# EAGLE schematic Cineo-6-Channel_Buck_A1 (EAGLE 9.5.2)

## Sheet 1 of 7
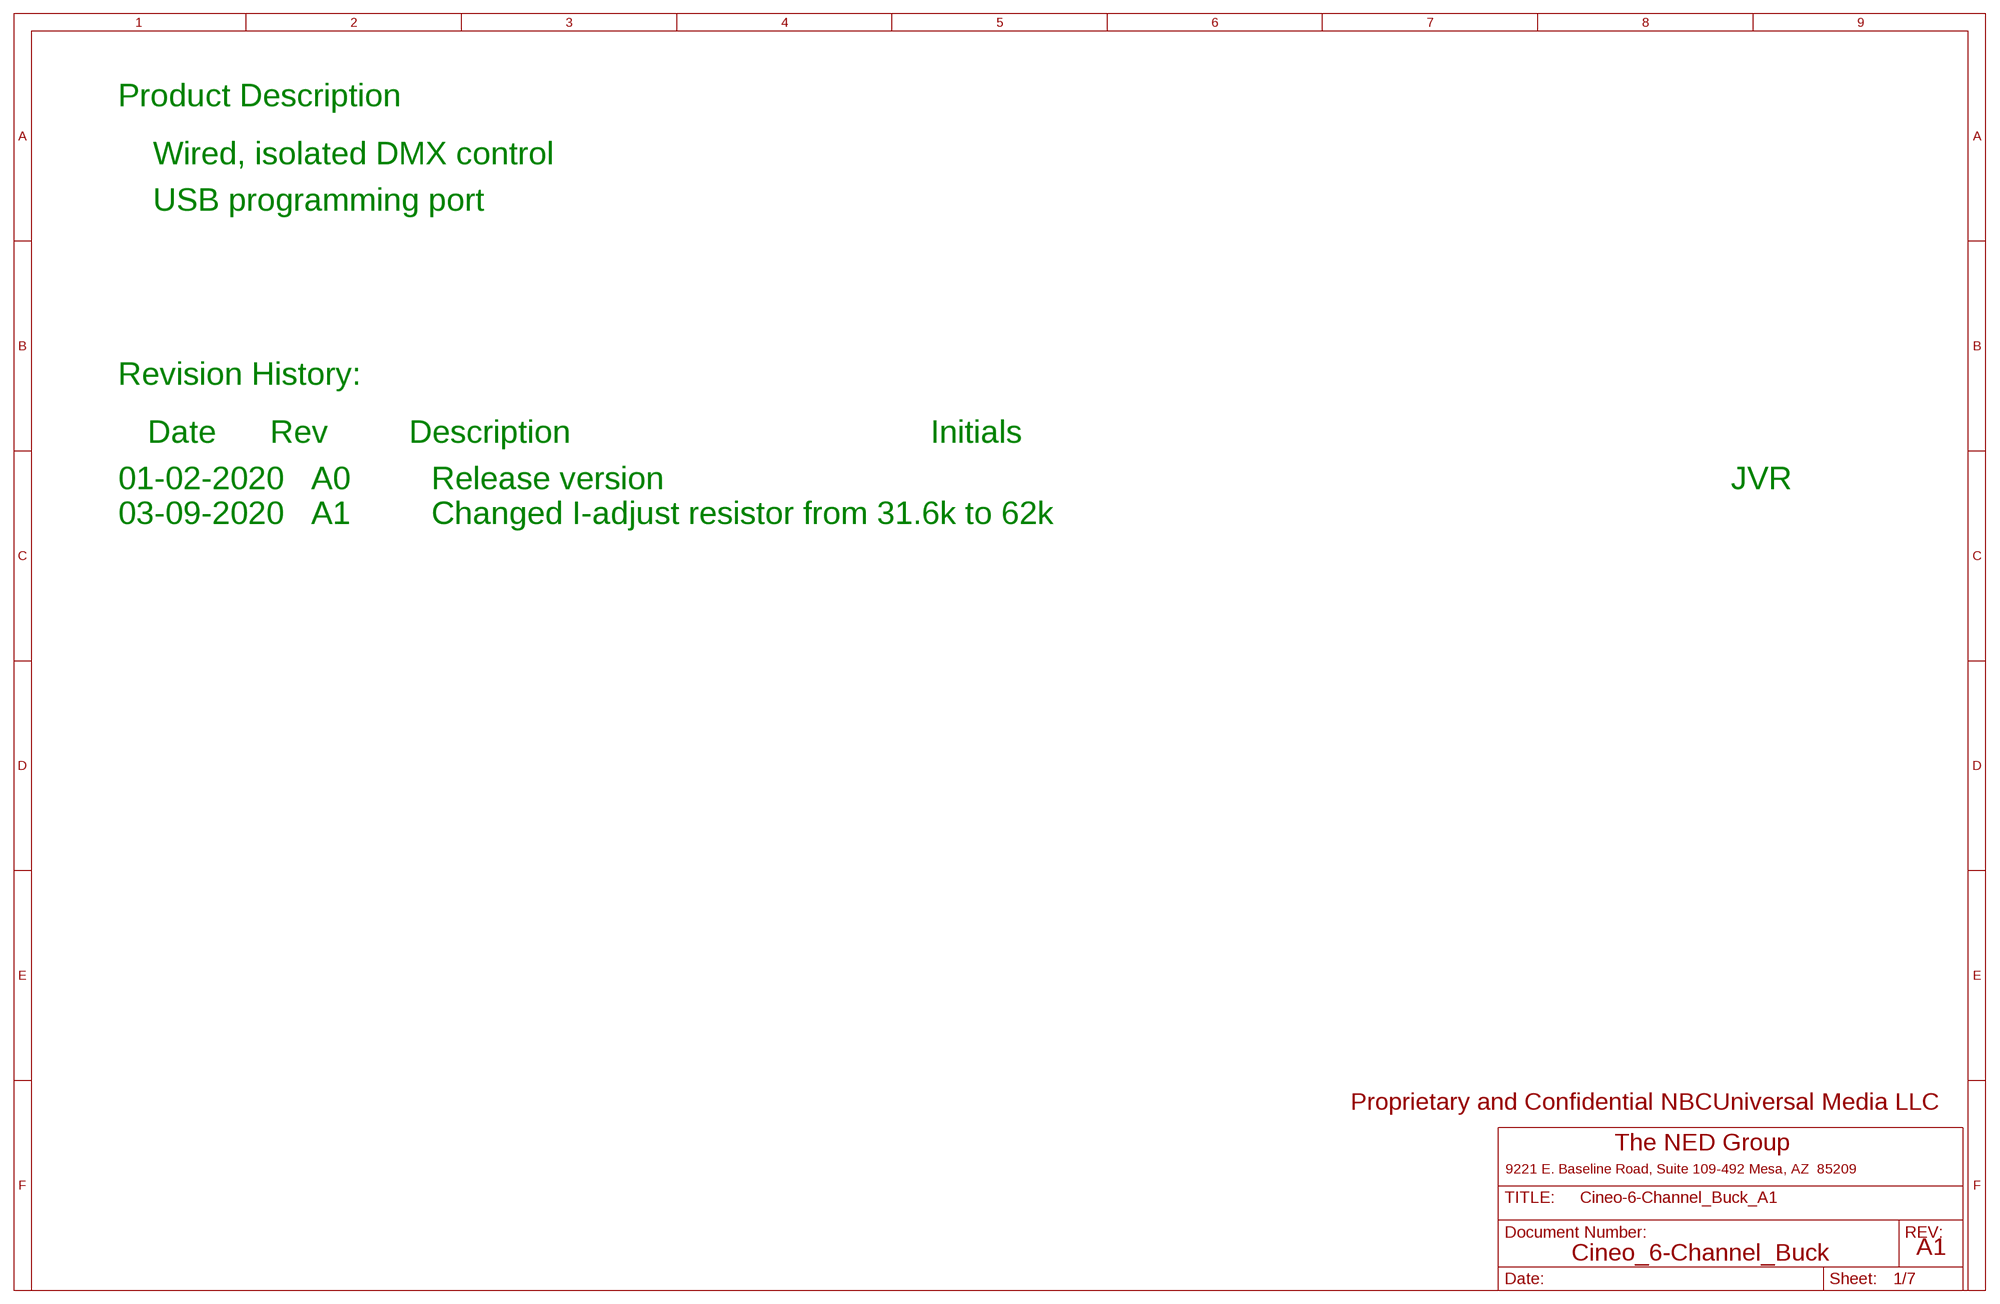
[diagram p0: schematic, sheet 1]

### Notes on the sheet
- Product Description
- Wired, isolated DMX control
- USB programming port
- Revision History:
- Date      Rev         Description                                        Initials
- 01-02-2020   A0         Release version | JVR
- 03-09-2020   A1         Changed I-adjust resistor from 31.6k to 62k
- Proprietary and Confidential NBCUniversal Media LLC
- The NED Group
- 9221 E. Baseline Road, Suite 109-492 Mesa, AZ  85209
- Cineo_6-Channel_Buck | A1

## Sheet 2 of 7
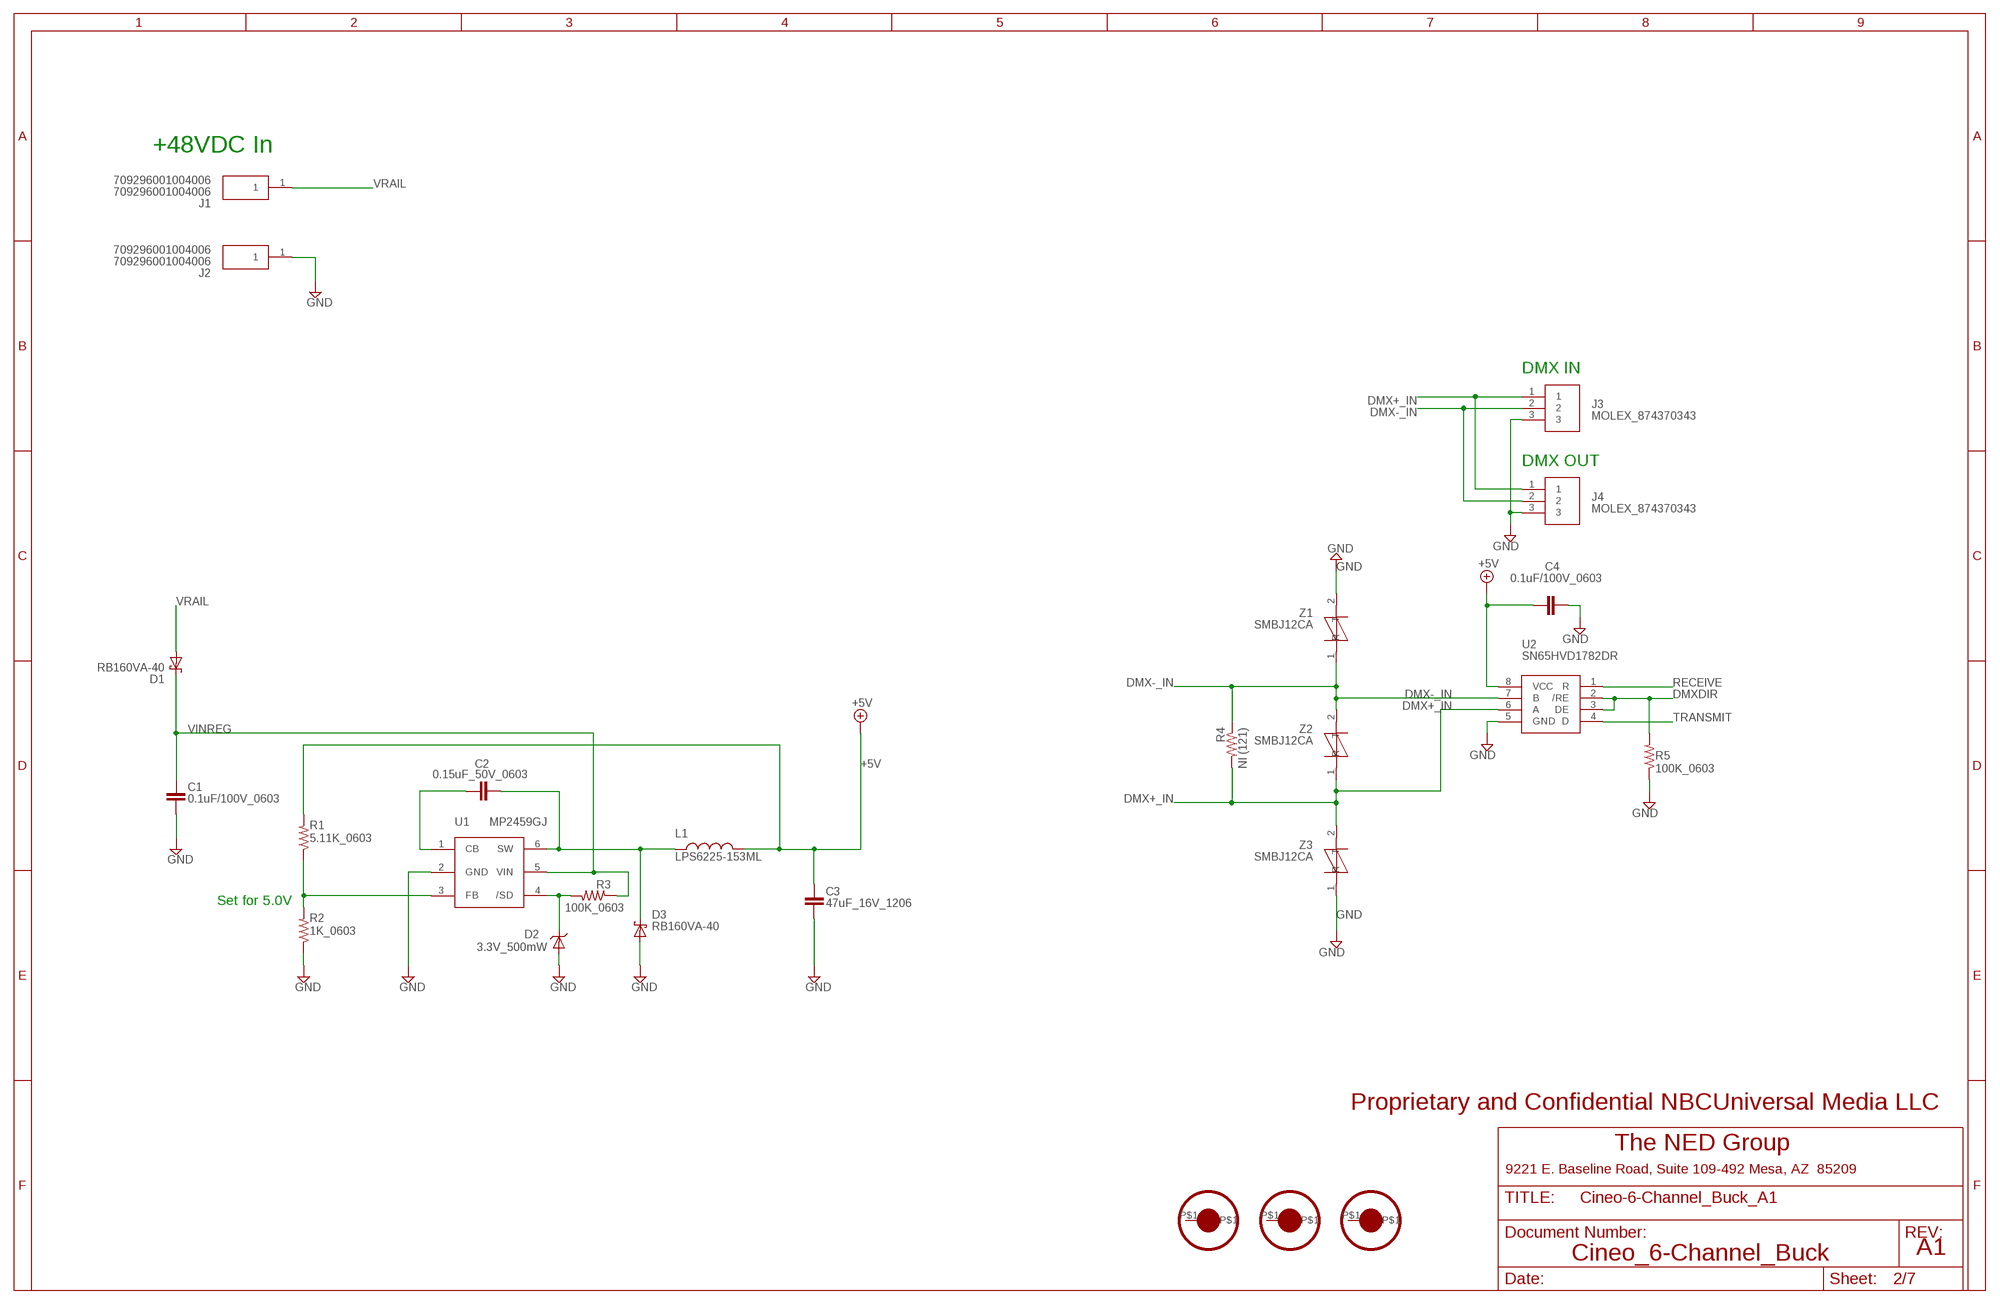
[diagram p1: schematic, sheet 2]

### Parts
C1  0.1uF/100V_0603  0603_0.1UF_100V  [C0603]
C2  0.15uF_50V_0603  0603_0.15_50V  [C0603]
C3  47uF_16V_1206  1206_47UF_16V  [C1206]
C4  0.1uF/100V_0603  0603_0.1UF_100V  [C0603]
D1  RB160VA-40  ROHM_RB160VA-40  [TUMD2]
D2  3.3V_500mW  ZENERSOD-123  [SOD-123]
D3  RB160VA-40  ROHM_RB160VA-40  [TUMD2]
FID1  FIDUCIALSSMALLER  [FIDUCIAL_1MMX3MM]
FID2  FIDUCIALSSMALLER  [FIDUCIAL_1MMX3MM]
FID3  FIDUCIALSSMALLER  [FIDUCIAL_1MMX3MM]
J1  709296001004006  AVX_709296001004006  [AVX_709296001004006]
J2  709296001004006  AVX_709296001004006  [AVX_709296001004006]
J3  MOLEX_874370343  [MOLEX_874370343]
J4  MOLEX_874370343  [MOLEX_874370343]
L1  LPS6225-153ML  COILCRAFT_LPS6225-153  [COILCRAFT_LPS6235]
R1  5.11K_0603  0603_5.11KΩ  [R0603]
R2  1K_0603  0603_1KΩ  [R0603]
R3  100K_0603  0603_100KΩ  [R0603]
R4  NI (121)  R-US_R0603  [R0603]
R5  100K_0603  R-US_R0603  [R0603]
U1  MP2459GJ  MPS_MP2459GJ  [TSOT_23-6]
U2  SN65HVD1782DR  TI_SN65HVD1782DR  [SO-8]
Z1  SMBJ12CA  TISP4360H3BJ  [SMBJ]
Z2  SMBJ12CA  TISP4360H3BJ  [SMBJ]
Z3  SMBJ12CA  TISP4360H3BJ  [SMBJ]

### Nets
+5V: C3.1 C4.1 L1.2 R1.2 U2.8(VCC) ; also sheet 3,4,5,6,7
DMX+_IN: J3.1 J4.1 R4.2 U2.6(A) Z2.1(R) Z3.2(T)
DMX-_IN: J3.2 J4.2 R4.1 U2.7(B) Z1.1(R) Z2.2(T)
DMXDIR: R5.2 U2.2(/RE) U2.3(DE) ; also sheet 3
GND [power]: C1.2 C3.2 C4.2 D2.A D3.A J2.1 J3.3 J4.3 R2.1 R5.1 U1.2(GND) U2.5(GND) Z1.2(T) Z3.1(R) ; also sheet 3,4,5,6,7
N$165: C2.1 U1.1(CB)
N$166: C2.2 D3.C L1.1 U1.6(SW)
N$167: R1.1 R2.2 U1.3(FB)
N$168: D2.C R3.2 U1.4(/SD)
RECEIVE: U2.1(R) ; also sheet 3
TRANSMIT: U2.4(D) ; also sheet 3
VINREG [power]: C1.1 D1.C R3.1 U1.5(VIN)
VRAIL [power]: D1.A J1.1 ; also sheet 3,5,6,7
Unconnected: FID1.P$1 FID2.P$1 FID3.P$1

### Notes on the sheet
- +48VDC In
- DMX IN
- DMX OUT
- Set for 5.0V
- Proprietary and Confidential NBCUniversal Media LLC
- The NED Group
- 9221 E. Baseline Road, Suite 109-492 Mesa, AZ  85209
- Cineo_6-Channel_Buck | A1

## Sheet 3 of 7
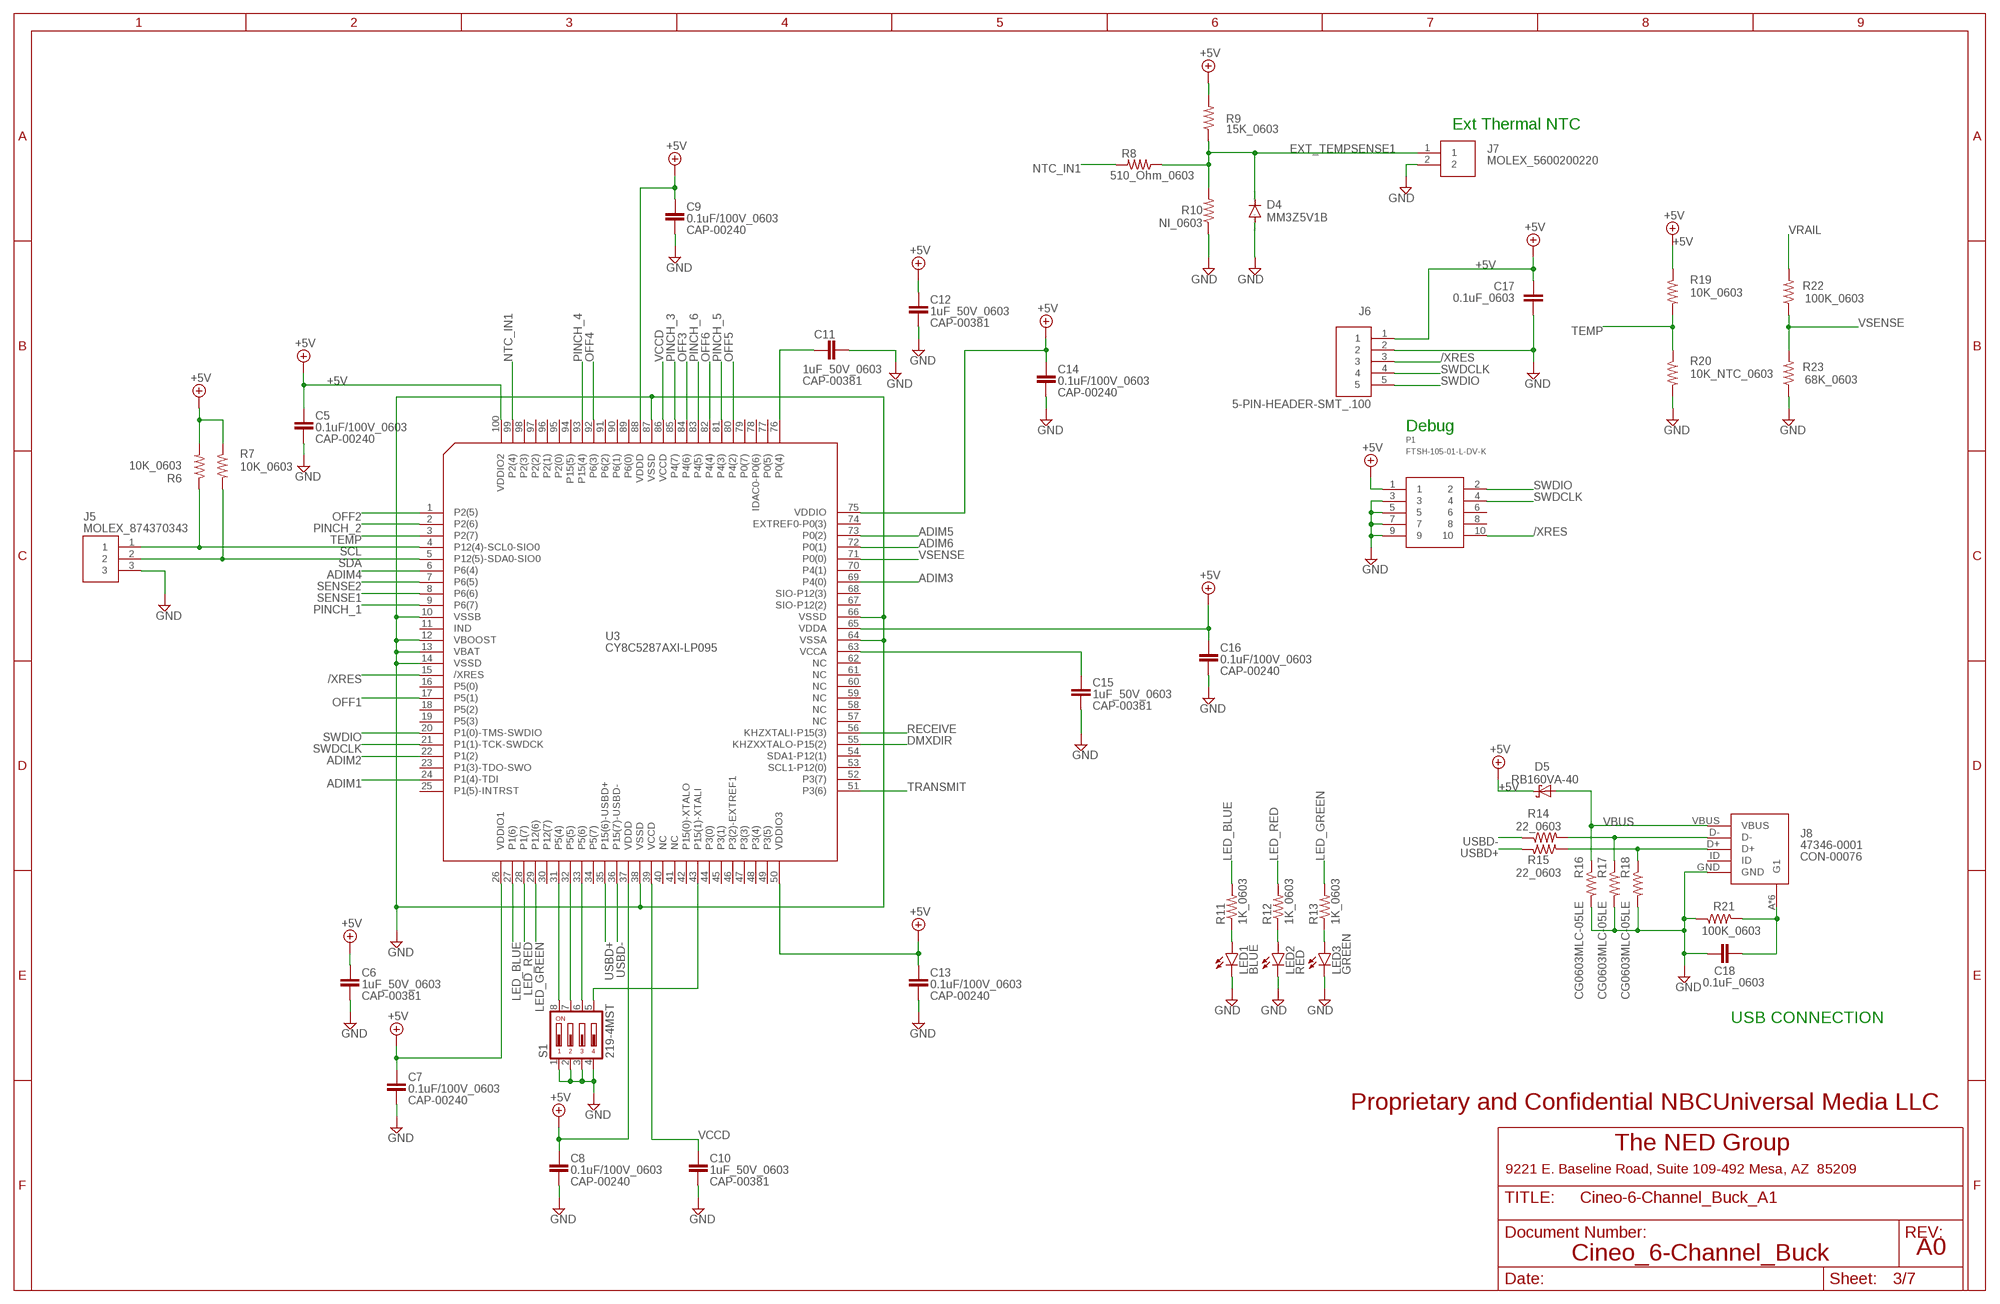
[diagram p2: schematic, sheet 3]

### Parts
C5  0.1uF/100V_0603  0603_0.1UF_100V  [C0603]
C6  1uF_50V_0603  0603_1UF_50V  [C0603]
C7  0.1uF/100V_0603  0603_0.1UF_100V  [C0603]
C8  0.1uF/100V_0603  0603_0.1UF_100V  [C0603]
C9  0.1uF/100V_0603  0603_0.1UF_100V  [C0603]
C10  1uF_50V_0603  0603_1UF_50V  [C0603]
C11  1uF_50V_0603  0603_1UF_50V  [C0603]
C12  1uF_50V_0603  0603_1UF_50V  [C0603]
C13  0.1uF/100V_0603  0603_0.1UF_100V  [C0603]
C14  0.1uF/100V_0603  0603_0.1UF_100V  [C0603]
C15  1uF_50V_0603  0603_1UF_50V  [C0603]
C16  0.1uF/100V_0603  0603_0.1UF_100V  [C0603]
C17  0.1uF_0603  C-EUC0603  [C0603]
C18  0.1uF_0603  C-EUC0603  [C0603]
D4  MM3Z5V1B  DIODE-SOD323-R  [SOD323-R]
D5  RB160VA-40  RSX051VA-30  [TUMD2]
J5  MOLEX_874370343  [MOLEX_874370343]
J6  5-PIN-HEADER-SMT_.100  [5-PIN_SMT_.100]
J7  MOLEX_5600200220  [MOLEX_5600200220]
J8  47346-0001  MOLEX_47346  [MOLEX_47346]
LED1  BLUE  LEDCHIPLED_0805  [CHIPLED_0805]
LED2  RED  LEDCHIPLED_0805  [CHIPLED_0805]
LED3  GREEN  LEDCHIPLED_0805  [CHIPLED_0805]
P1  FTSH-105-01-L-DV-K  [SAMTEC_FTSH-105-01-L-DV-K]
R6  10K_0603  R-US_R0603  [R0603]
R7  10K_0603  R-US_R0603  [R0603]
R8  510_Ohm_0603  R-US_R0603  [R0603]
R9  15K_0603  R-US_R0603  [R0603]
R10  NI_0603  R-US_R0603  [R0603]
R11  1K_0603  R-US_R0603  [R0603]
R12  1K_0603  R-US_R0603  [R0603]
R13  1K_0603  R-US_R0603  [R0603]
R14  22_0603  R-US_R0603  [R0603]
R15  22_0603  R-US_R0603  [R0603]
R16  CG0603MLC-05LE  R-US_R0603  [R0603]
R17  CG0603MLC-05LE  R-US_R0603  [R0603]
R18  CG0603MLC-05LE  R-US_R0603  [R0603]
R19  10K_0603  R-US_R0603  [R0603]
R20  10K_NTC_0603  R-US_R0603  [R0603]
R21  100K_0603  R-US_R0603  [R0603]
R22  100K_0603  R-US_R0603  [R0603]
R23  68K_0603  R-US_R0603  [R0603]
S1  219-4MST  219-04  [CTS-219-04]
U3  CY8C5287AXI-LP095  CYPRESS_CY8C52XX_100PIN5287  [TQFP100]

### Nets
+5V: C5.2 C6.2 C7.2 C8.2 C9.2 C12.2 C13.2 C14.2 C16.2 C17.1 D5.C J6.1 P1.1 R6.2 R7.1 R9.2 R19.1 U3.26(VDDIO1) U3.37(VDDD) U3.50(VDDIO3) U3.65(VDDA) U3.75(VDDIO) U3.88(VDDD) U3.100(VDDIO2) ; also sheet 2,4,5,6,7
/XRES: J6.3 P1.10 U3.15(/XRES)
ADIM1: U3.24(P1(4)-TDI) ; also sheet 4
ADIM2: U3.22(P1(2)) ; also sheet 4
ADIM3: U3.69(P4(0)) ; also sheet 4
ADIM4: U3.6(P6(4)) ; also sheet 4
ADIM5: U3.73(P0(2)) ; also sheet 4
ADIM6: U3.72(P0(1)) ; also sheet 4
DMXDIR: U3.55(KHZXXTALO-P15(2)) ; also sheet 2
EXT_TEMPSENSE1: D4.C J7.1 R8.1 R9.1 R10.2
GND [power]: C5.1 C6.1 C7.1 C8.1 C9.1 C10.1 C11.1 C12.1 C13.1 C14.1 C15.1 C16.1 C17.2 C18.2 D4.A J5.3 J6.2 J7.2 J8.GND LED1.C LED2.C LED3.C P1.3 P1.5 P1.7 P1.9 R10.1 R16.2 R17.2 R18.2 R20.2 R21.1 R23.1 S1.1 S1.2 S1.3 S1.4 U3.10(VSSB) U3.12(VBOOST) U3.13(VBAT) U3.14(VSSD) U3.38(VSSD) U3.64(VSSA) U3.66(VSSD) U3.87(VSSD) ; also sheet 2,4,5,6,7
LED_BLUE: R11.2 U3.27(P1(6))
LED_GREEN: R13.2 U3.29(P12(6))
LED_RED: R12.2 U3.28(P1(7))
N$1: C15.2 U3.63(VCCA)
N$2: S1.8 U3.31(P5(4))
N$6: S1.7 U3.32(P5(5))
N$7: C11.2 U3.76(P0(4))
N$18: S1.6 U3.33(P5(6))
N$19: S1.5 U3.43(P15(1)-XTALI)
N$24: LED3.A R13.1
N$31: LED2.A R12.1
N$96: J8.D- R14.2 R17.1
N$97: J8.D+ R15.1 R18.1
N$118: C18.1 J8.A(G1) J8.B(G1) J8.G1 J8.S2(G1) J8.S3(G1) J8.S4(G1) R21.2
N$172: LED1.A R11.1
NTC_IN1: R8.2 U3.99(P2(4))
OFF1: U3.17(P5(1)) ; also sheet 5
OFF2: U3.1(P2(5)) ; also sheet 5
OFF3: U3.84(P4(6)) ; also sheet 6
OFF4: U3.92(P6(3)) ; also sheet 6
OFF5: U3.80(P4(2)) ; also sheet 7
OFF6: U3.82(P4(4)) ; also sheet 7
PINCH_1: U3.9(P6(7)) ; also sheet 5
PINCH_2: U3.2(P2(6)) ; also sheet 5
PINCH_3: U3.85(P4(7)) ; also sheet 6
PINCH_4: U3.93(P15(4)) ; also sheet 6
PINCH_5: U3.81(P4(3)) ; also sheet 7
PINCH_6: U3.83(P4(5)) ; also sheet 7
RECEIVE: U3.56(KHZXTALI-P15(3)) ; also sheet 2
SCL: J5.1 R6.1 U3.4(P12(4)-SCL0-SIO0)
SDA: J5.2 R7.2 U3.5(P12(5)-SDA0-SIO0)
SENSE1: U3.8(P6(6)) ; also sheet 5
SENSE2: U3.7(P6(5)) ; also sheet 5
SWDCLK: J6.4 P1.4 U3.21(P1(1)-TCK-SWDCK)
SWDIO: J6.5 P1.2 U3.20(P1(0)-TMS-SWDIO)
TEMP: R19.2 R20.1 U3.3(P2(7))
TRANSMIT: U3.51(P3(6)) ; also sheet 2
USBD+: R15.2 U3.35(P15(6)-USBD+)
USBD-: R14.1 U3.36(P15(7)-USBD-)
VBUS: D5.A J8.VBUS R16.1
VCCD: C10.2 U3.39(VCCD) U3.86(VCCD)
VRAIL [power]: R22.2 ; also sheet 2,5,6,7
VSENSE: R22.1 R23.2 U3.71(P0(0))
Unconnected: J8.ID P1.6 P1.8 U3.11(IND) U3.16(P5(0)) U3.18(P5(2)) U3.19(P5(3)) U3.23(P1(3)-TDO-SWO) U3.25(P1(5)-INTRST) U3.30(P12(7)) U3.34(P5(7)) U3.40(NC) U3.41(NC) U3.42(P15(0)-XTALO) U3.44(P3(0)) U3.45(P3(1)) U3.46(P3(2)-EXTREF1) U3.47(P3(3)) U3.48(P3(4)) U3.49(P3(5)) U3.52(P3(7)) U3.53(SCL1-P12(0)) U3.54(SDA1-P12(1)) U3.57(NC) U3.58(NC) U3.59(NC) U3.60(NC) U3.61(NC) U3.62(NC) U3.67(SIO-P12(2)) U3.68(SIO-P12(3)) U3.70(P4(1)) U3.74(EXTREF0-P0(3)) U3.77(P0(5)) U3.78(IDAC0-P0(6)) U3.79(P0(7)) U3.89(P6(0)) U3.90(P6(1)) U3.91(P6(2)) U3.94(P15(5)) U3.95(P2(0)) U3.96(P2(1)) U3.97(P2(2)) U3.98(P2(3))

### Notes on the sheet
- Ext Thermal NTC
- Debug
- USB CONNECTION
- Proprietary and Confidential NBCUniversal Media LLC
- The NED Group
- 9221 E. Baseline Road, Suite 109-492 Mesa, AZ  85209
- Cineo_6-Channel_Buck | A0

## Sheet 4 of 7
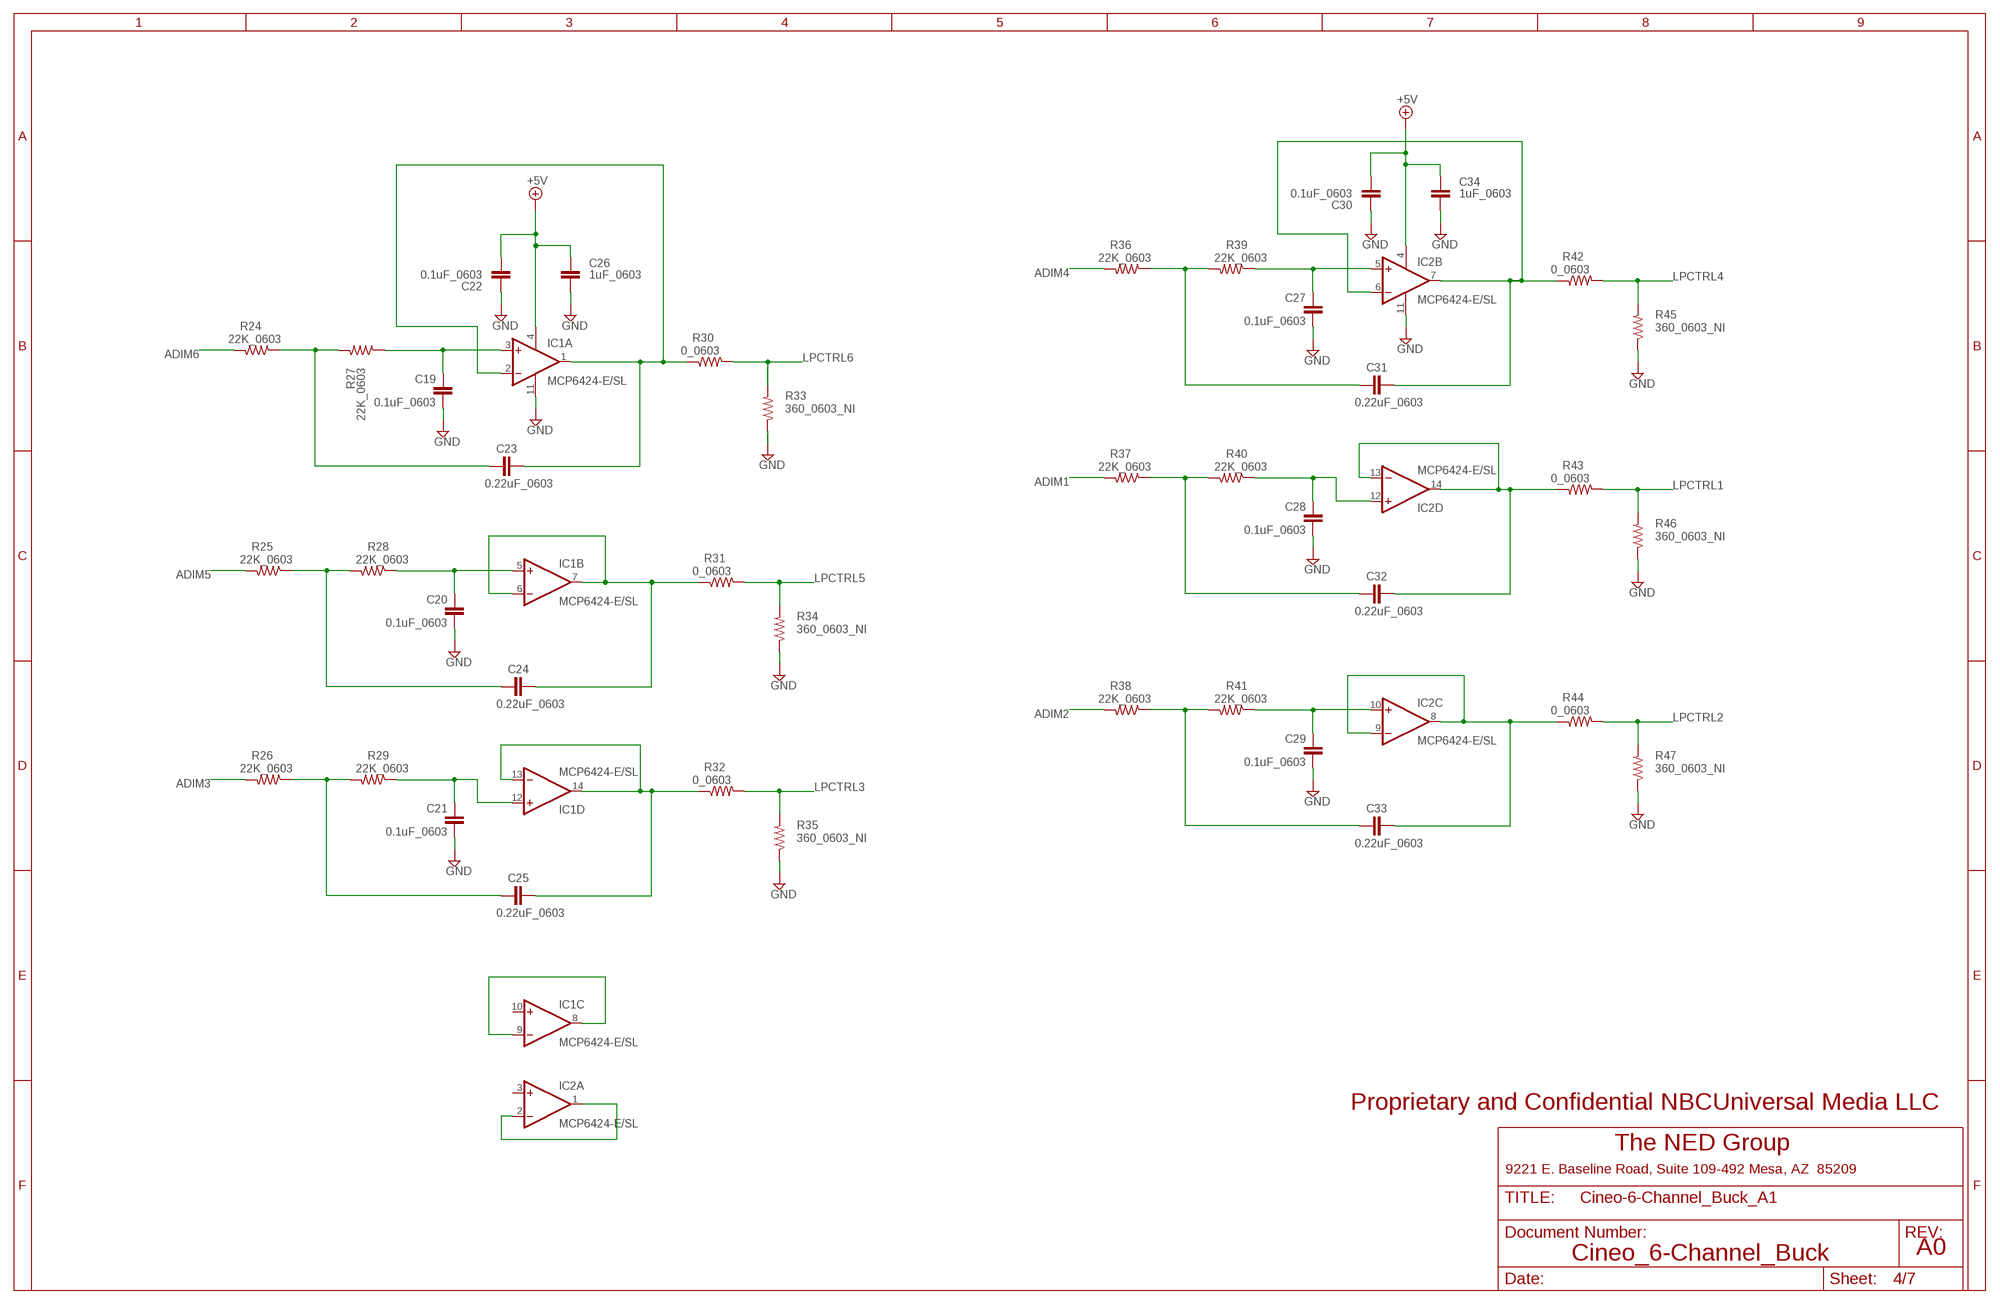
[diagram p3: schematic, sheet 4]

### Parts
C19  0.1uF_0603  C-EUC0603  [C0603]
C20  0.1uF_0603  C-EUC0603  [C0603]
C21  0.1uF_0603  C-EUC0603  [C0603]
C22  0.1uF_0603  C-EUC0603  [C0603]
C23  0.22uF_0603  C-EUC0603  [C0603]
C24  0.22uF_0603  C-EUC0603  [C0603]
C25  0.22uF_0603  C-EUC0603  [C0603]
C26  1uF_0603  C-EUC0603  [C0603]
C27  0.1uF_0603  C-EUC0603  [C0603]
C28  0.1uF_0603  C-EUC0603  [C0603]
C29  0.1uF_0603  C-EUC0603  [C0603]
C30  0.1uF_0603  C-EUC0603  [C0603]
C31  0.22uF_0603  C-EUC0603  [C0603]
C32  0.22uF_0603  C-EUC0603  [C0603]
C33  0.22uF_0603  C-EUC0603  [C0603]
C34  1uF_0603  C-EUC0603  [C0603]
IC1  MCP6424-E/SL  TLC274D  [SO14]
IC2  MCP6424-E/SL  TLC274D  [SO14]
R24  22K_0603  R-US_R0603  [R0603]
R25  22K_0603  R-US_R0603  [R0603]
R26  22K_0603  R-US_R0603  [R0603]
R27  22K_0603  R-US_R0603  [R0603]
R28  22K_0603  R-US_R0603  [R0603]
R29  22K_0603  R-US_R0603  [R0603]
R30  0_0603  R-US_R0603  [R0603]
R31  0_0603  R-US_R0603  [R0603]
R32  0_0603  R-US_R0603  [R0603]
R33  360_0603_NI  R-US_R0603  [R0603]
R34  360_0603_NI  R-US_R0603  [R0603]
R35  360_0603_NI  R-US_R0603  [R0603]
R36  22K_0603  R-US_R0603  [R0603]
R37  22K_0603  R-US_R0603  [R0603]
R38  22K_0603  R-US_R0603  [R0603]
R39  22K_0603  R-US_R0603  [R0603]
R40  22K_0603  R-US_R0603  [R0603]
R41  22K_0603  R-US_R0603  [R0603]
R42  0_0603  R-US_R0603  [R0603]
R43  0_0603  R-US_R0603  [R0603]
R44  0_0603  R-US_R0603  [R0603]
R45  360_0603_NI  R-US_R0603  [R0603]
R46  360_0603_NI  R-US_R0603  [R0603]
R47  360_0603_NI  R-US_R0603  [R0603]

### Nets
+5V: C22.1 C26.2 C30.1 C34.2 IC1.4(P:V+) IC2.4(P:V+) ; also sheet 2,3,5,6,7
ADIM1: R37.2 ; also sheet 3
ADIM2: R38.2 ; also sheet 3
ADIM3: R26.2 ; also sheet 3
ADIM4: R36.2 ; also sheet 3
ADIM5: R25.2 ; also sheet 3
ADIM6: R24.2 ; also sheet 3
GND [power]: C19.1 C20.1 C21.1 C22.2 C26.1 C27.1 C28.1 C29.1 C30.2 C34.1 IC1.11(P:V-) IC2.11(P:V-) R33.1 R34.1 R35.1 R45.1 R46.1 R47.1 ; also sheet 2,3,5,6,7
LPCTRL1: R43.2 R46.2 ; also sheet 5
LPCTRL2: R44.2 R47.2 ; also sheet 5
LPCTRL3: R32.2 R35.2 ; also sheet 6
LPCTRL4: R42.2 R45.2 ; also sheet 6
LPCTRL5: R31.2 R34.2 ; also sheet 7
LPCTRL6: R30.2 R33.2 ; also sheet 7
N$3: C24.1 R25.1 R28.2
N$4: C20.2 IC1.5(B:+IN) R28.1
N$8: C24.2 IC1.6(B:-IN) IC1.7(B:OUT) R31.1
N$10: C23.1 R24.1 R27.2
N$13: C19.2 IC1.3(A:+IN) R27.1
N$14: IC1.8(C:OUT) IC1.9(C:-IN)
N$15: C25.1 R26.1 R29.2
N$16: C21.2 IC1.12(D:+IN) R29.1
N$17: C25.2 IC1.13(D:-IN) IC1.14(D:OUT) R32.1
N$20: IC2.1(A:OUT) IC2.2(A:-IN)
N$21: C23.2 IC1.1(A:OUT) IC1.2(A:-IN) R30.1
N$135: C31.1 R36.1 R39.2
N$136: C27.2 IC2.5(B:+IN) R39.1
N$137: C31.2 IC2.6(B:-IN) IC2.7(B:OUT) R42.1
N$138: C33.1 R38.1 R41.2
N$155: C29.2 IC2.10(C:+IN) R41.1
N$156: C33.2 IC2.8(C:OUT) IC2.9(C:-IN) R44.1
N$157: C32.1 R37.1 R40.2
N$158: C28.2 IC2.12(D:+IN) R40.1
N$159: C32.2 IC2.13(D:-IN) IC2.14(D:OUT) R43.1
Unconnected: IC1.10(C:+IN) IC2.3(A:+IN)

### Notes on the sheet
- Proprietary and Confidential NBCUniversal Media LLC
- The NED Group
- 9221 E. Baseline Road, Suite 109-492 Mesa, AZ  85209
- Cineo_6-Channel_Buck | A0

## Sheet 5 of 7
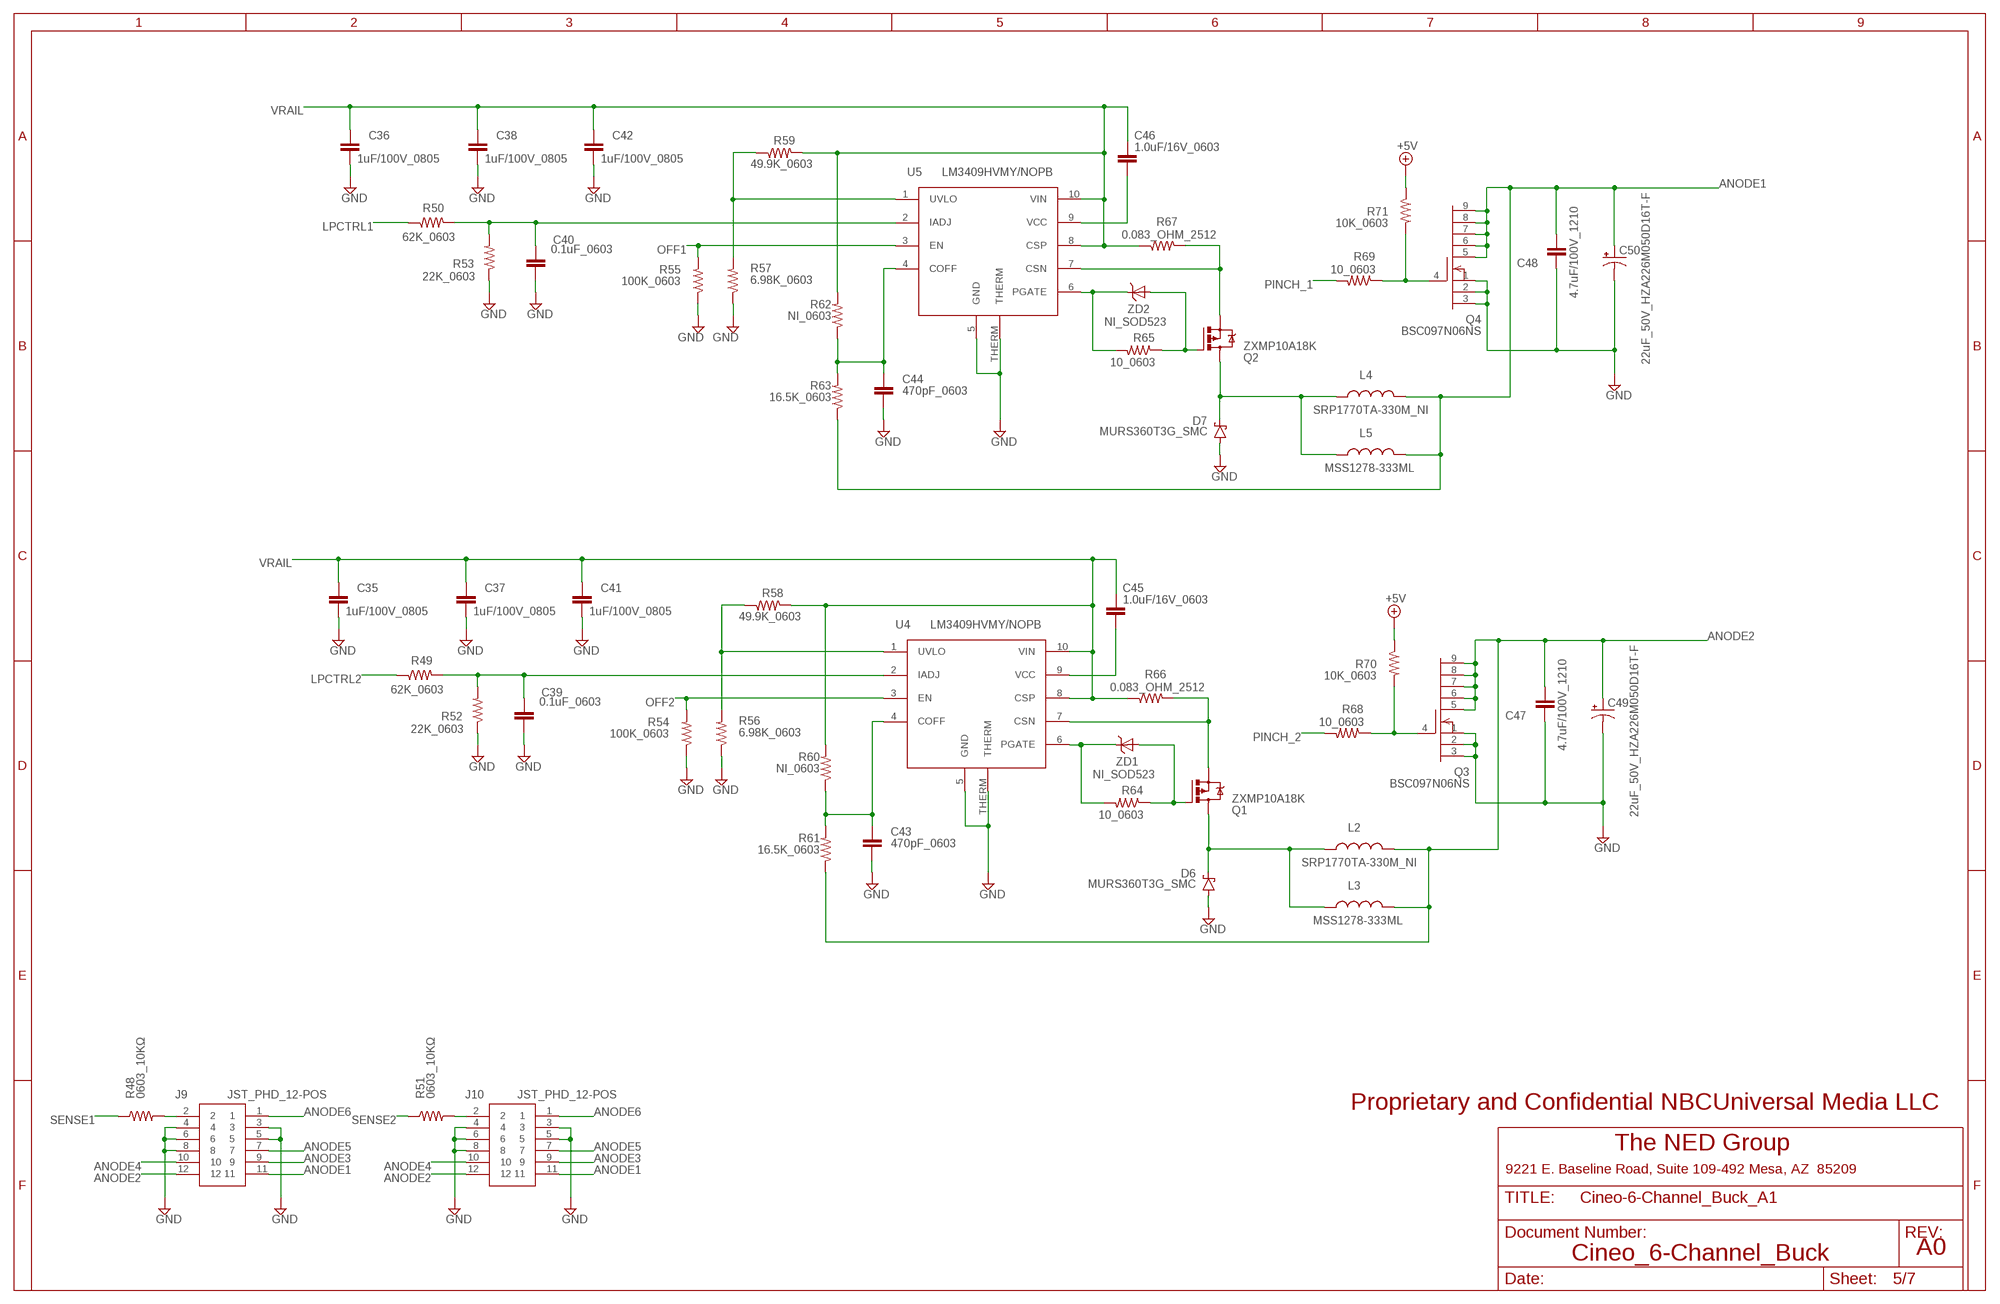
[diagram p4: schematic, sheet 5]

### Parts
C35  1uF/100V_0805  C-EUC0805  [C0805]
C36  1uF/100V_0805  C-EUC0805  [C0805]
C37  1uF/100V_0805  C-EUC0805  [C0805]
C38  1uF/100V_0805  C-EUC0805  [C0805]
C39  0.1uF_0603  C-EUC0603  [C0603]
C40  0.1uF_0603  C-EUC0603  [C0603]
C41  1uF/100V_0805  C-EUC0805  [C0805]
C42  1uF/100V_0805  C-EUC0805  [C0805]
C43  470pF_0603  C-EUC0603  [C0603]
C44  470pF_0603  C-EUC0603  [C0603]
C45  1.0uF/16V_0603  C-EUC0603  [C0603]
C46  1.0uF/16V_0603  C-EUC0603  [C0603]
C47  4.7uF/100V_1210  C-EUC1210  [C1210]
C48  4.7uF/100V_1210  C-EUC1210  [C1210]
C49  22uF_50V_HZA226M050D16T-F  CPOL-USD  [PANASONIC_D]
C50  22uF_50V_HZA226M050D16T-F  CPOL-USD  [PANASONIC_D]
D6  MURS360T3G_SMC  SCHOTTKY-DIODESMC  [SMC]
D7  MURS360T3G_SMC  SCHOTTKY-DIODESMC  [SMC]
J9  JST_PHD_12-POS  [JST_PHD_12-POS]
J10  JST_PHD_12-POS  [JST_PHD_12-POS]
L2  SRP1770TA-330M_NI  BOURNS_SRP1770TA  [BOURNS_SRP1770TA]
L3  MSS1278-333ML  COILCRAFT_MSS1260  [MSS1260]
L4  SRP1770TA-330M_NI  BOURNS_SRP1770TA  [BOURNS_SRP1770TA]
L5  MSS1278-333ML  COILCRAFT_MSS1260  [MSS1260]
Q1  ZXMP10A18K  MOSFET_P-CHANNEL_3LEADTAB_SOURCE  [DPAK]
Q2  ZXMP10A18K  MOSFET_P-CHANNEL_3LEADTAB_SOURCE  [DPAK]
Q3  BSC097N06NS  SI7464DP_SO8_POWERPAC  [SO-8_POWERPAC]
Q4  BSC097N06NS  SI7464DP_SO8_POWERPAC  [SO-8_POWERPAC]
R48  0603_10KΩ  [R0603]
R49  62K_0603  R-US_R0603  [R0603]
R50  62K_0603  R-US_R0603  [R0603]
R51  0603_10KΩ  [R0603]
R52  22K_0603  R-US_R0603  [R0603]
R53  22K_0603  R-US_R0603  [R0603]
R54  100K_0603  R-US_R0603  [R0603]
R55  100K_0603  R-US_R0603  [R0603]
R56  6.98K_0603  R-US_R0603  [R0603]
R57  6.98K_0603  R-US_R0603  [R0603]
R58  49.9K_0603  R-US_R0603  [R0603]
R59  49.9K_0603  R-US_R0603  [R0603]
R60  NI_0603  R-US_R0603  [R0603]
R61  16.5K_0603  R-US_R0603  [R0603]
R62  NI_0603  R-US_R0603  [R0603]
R63  16.5K_0603  R-US_R0603  [R0603]
R64  10_0603  R-US_R0603  [R0603]
R65  10_0603  R-US_R0603  [R0603]
R66  0.083_OHM_2512  R-US_R2512  [R2512]
R67  0.083_OHM_2512  R-US_R2512  [R2512]
R68  10_0603  R-US_R0603  [R0603]
R69  10_0603  R-US_R0603  [R0603]
R70  10K_0603  R-US_R0603  [R0603]
R71  10K_0603  R-US_R0603  [R0603]
U4  LM3409HVMY/NOPB  LM3409HV  [MSOP10-THERMALENHANCED]
U5  LM3409HVMY/NOPB  LM3409HV  [MSOP10-THERMALENHANCED]
ZD1  NI_SOD523  ZENER_SOD-523  [SOD-523]
ZD2  NI_SOD523  ZENER_SOD-523  [SOD-523]

### Nets
+5V: R70.1 R71.1 ; also sheet 2,3,4,6,7
ANODE1: C48.2 C50.+ J9.11 J10.11 L4.P$2 L5.2 Q4.5(D) Q4.6(D1) Q4.7(D2) Q4.8(D3) Q4.9(D4) R63.1
ANODE2: C47.2 C49.+ J9.12 J10.12 L2.P$2 L3.2 Q3.5(D) Q3.6(D1) Q3.7(D2) Q3.8(D3) Q3.9(D4) R61.1
ANODE3: J9.9 J10.9 ; also sheet 6
ANODE4: J9.10 J10.10 ; also sheet 6
ANODE5: J9.7 J10.7 ; also sheet 7
ANODE6: J9.1 J10.1 ; also sheet 7
GND [power]: C35.2 C36.2 C37.2 C38.2 C39.1 C40.1 C41.2 C42.2 C43.1 C44.1 C47.1 C48.1 C49.- C50.- D6.A D7.A J9.3 J9.4 J9.5 J9.6 J9.8 J10.3 J10.4 J10.5 J10.6 J10.8 Q3.1(S) Q3.2(S1) Q3.3(S2) Q4.1(S) Q4.2(S1) Q4.3(S2) R52.1 R53.1 R54.1 R55.1 R56.1 R57.1 U4.5(GND) U4.THERM U5.5(GND) U5.THERM ; also sheet 2,3,4,6,7
LPCTRL1: R50.1 ; also sheet 4
LPCTRL2: R49.1 ; also sheet 4
N$5: C44.2 R62.1 R63.2 U5.4(COFF)
N$9: C46.1 U5.9(VCC)
N$11: Q2.E(S) R67.2 U5.7(CSN)
N$12: Q2.B(G) R65.1 ZD2.A
N$23: R65.2 U5.6(PGATE) ZD2.C
N$25: D7.C L4.P$1 L5.1 Q2.C(D)
N$28: J9.2 R48.2
N$29: J10.2 R51.2
N$40: R56.2 R58.1 U4.1(UVLO)
N$41: C39.2 R49.2 R52.2 U4.2(IADJ)
N$42: Q3.4(G) R68.1 R70.2
N$43: C43.2 R60.1 R61.2 U4.4(COFF)
N$44: C45.1 U4.9(VCC)
N$45: Q1.E(S) R66.2 U4.7(CSN)
N$46: Q1.B(G) R64.1 ZD1.A
N$47: R64.2 U4.6(PGATE) ZD1.C
N$48: D6.C L2.P$1 L3.1 Q1.C(D)
N$69: R57.2 R59.1 U5.1(UVLO)
N$80: C40.2 R50.2 R53.2 U5.2(IADJ)
N$82: Q4.4(G) R69.1 R71.2
OFF1: R55.2 U5.3(EN) ; also sheet 3
OFF2: R54.2 U4.3(EN) ; also sheet 3
PINCH_1: R69.2 ; also sheet 3
PINCH_2: R68.2 ; also sheet 3
SENSE1: R48.1 ; also sheet 3
SENSE2: R51.1 ; also sheet 3
VRAIL [power]: C35.1 C36.1 C37.1 C38.1 C41.1 C42.1 C45.2 C46.2 R58.2 R59.2 R60.2 R62.2 R66.1 R67.1 U4.8(CSP) U4.10(VIN) U5.8(CSP) U5.10(VIN) ; also sheet 2,3,6,7

### Notes on the sheet
- Proprietary and Confidential NBCUniversal Media LLC
- The NED Group
- 9221 E. Baseline Road, Suite 109-492 Mesa, AZ  85209
- Cineo_6-Channel_Buck | A0

## Sheet 6 of 7
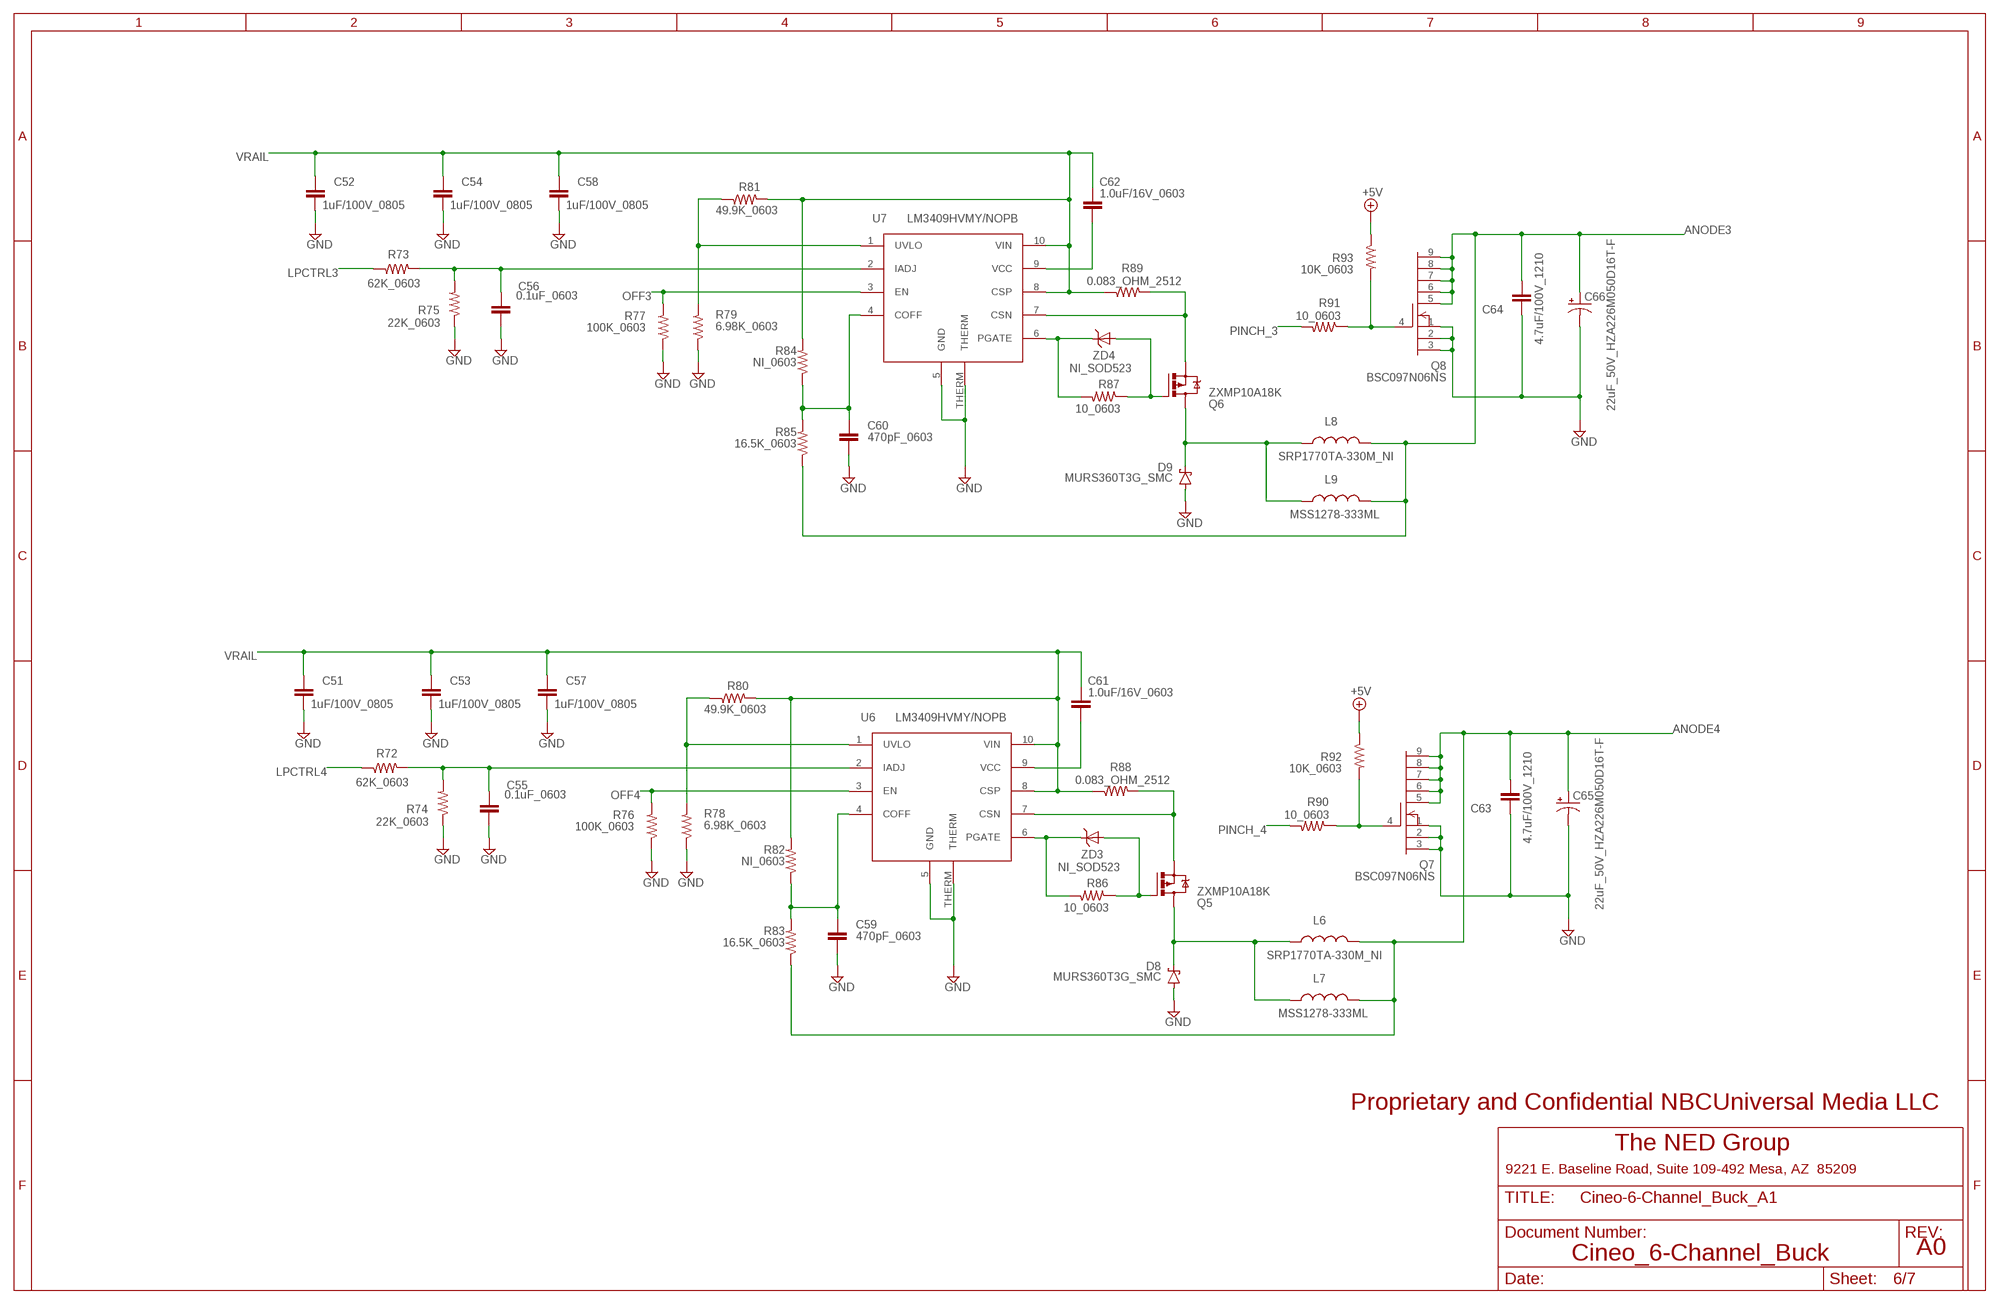
[diagram p5: schematic, sheet 6]

### Parts
C51  1uF/100V_0805  C-EUC0805  [C0805]
C52  1uF/100V_0805  C-EUC0805  [C0805]
C53  1uF/100V_0805  C-EUC0805  [C0805]
C54  1uF/100V_0805  C-EUC0805  [C0805]
C55  0.1uF_0603  C-EUC0603  [C0603]
C56  0.1uF_0603  C-EUC0603  [C0603]
C57  1uF/100V_0805  C-EUC0805  [C0805]
C58  1uF/100V_0805  C-EUC0805  [C0805]
C59  470pF_0603  C-EUC0603  [C0603]
C60  470pF_0603  C-EUC0603  [C0603]
C61  1.0uF/16V_0603  C-EUC0603  [C0603]
C62  1.0uF/16V_0603  C-EUC0603  [C0603]
C63  4.7uF/100V_1210  C-EUC1210  [C1210]
C64  4.7uF/100V_1210  C-EUC1210  [C1210]
C65  22uF_50V_HZA226M050D16T-F  CPOL-USD  [PANASONIC_D]
C66  22uF_50V_HZA226M050D16T-F  CPOL-USD  [PANASONIC_D]
D8  MURS360T3G_SMC  SCHOTTKY-DIODESMC  [SMC]
D9  MURS360T3G_SMC  SCHOTTKY-DIODESMC  [SMC]
L6  SRP1770TA-330M_NI  BOURNS_SRP1770TA  [BOURNS_SRP1770TA]
L7  MSS1278-333ML  COILCRAFT_MSS1260  [MSS1260]
L8  SRP1770TA-330M_NI  BOURNS_SRP1770TA  [BOURNS_SRP1770TA]
L9  MSS1278-333ML  COILCRAFT_MSS1260  [MSS1260]
Q5  ZXMP10A18K  MOSFET_P-CHANNEL_3LEADTAB_SOURCE  [DPAK]
Q6  ZXMP10A18K  MOSFET_P-CHANNEL_3LEADTAB_SOURCE  [DPAK]
Q7  BSC097N06NS  SI7464DP_SO8_POWERPAC  [SO-8_POWERPAC]
Q8  BSC097N06NS  SI7464DP_SO8_POWERPAC  [SO-8_POWERPAC]
R72  62K_0603  R-US_R0603  [R0603]
R73  62K_0603  R-US_R0603  [R0603]
R74  22K_0603  R-US_R0603  [R0603]
R75  22K_0603  R-US_R0603  [R0603]
R76  100K_0603  R-US_R0603  [R0603]
R77  100K_0603  R-US_R0603  [R0603]
R78  6.98K_0603  R-US_R0603  [R0603]
R79  6.98K_0603  R-US_R0603  [R0603]
R80  49.9K_0603  R-US_R0603  [R0603]
R81  49.9K_0603  R-US_R0603  [R0603]
R82  NI_0603  R-US_R0603  [R0603]
R83  16.5K_0603  R-US_R0603  [R0603]
R84  NI_0603  R-US_R0603  [R0603]
R85  16.5K_0603  R-US_R0603  [R0603]
R86  10_0603  R-US_R0603  [R0603]
R87  10_0603  R-US_R0603  [R0603]
R88  0.083_OHM_2512  R-US_R2512  [R2512]
R89  0.083_OHM_2512  R-US_R2512  [R2512]
R90  10_0603  R-US_R0603  [R0603]
R91  10_0603  R-US_R0603  [R0603]
R92  10K_0603  R-US_R0603  [R0603]
R93  10K_0603  R-US_R0603  [R0603]
U6  LM3409HVMY/NOPB  LM3409HV  [MSOP10-THERMALENHANCED]
U7  LM3409HVMY/NOPB  LM3409HV  [MSOP10-THERMALENHANCED]
ZD3  NI_SOD523  ZENER_SOD-523  [SOD-523]
ZD4  NI_SOD523  ZENER_SOD-523  [SOD-523]

### Nets
+5V: R92.1 R93.1 ; also sheet 2,3,4,5,7
ANODE3: C64.2 C66.+ L8.P$2 L9.2 Q8.5(D) Q8.6(D1) Q8.7(D2) Q8.8(D3) Q8.9(D4) R85.1 ; also sheet 5
ANODE4: C63.2 C65.+ L6.P$2 L7.2 Q7.5(D) Q7.6(D1) Q7.7(D2) Q7.8(D3) Q7.9(D4) R83.1 ; also sheet 5
GND [power]: C51.2 C52.2 C53.2 C54.2 C55.1 C56.1 C57.2 C58.2 C59.1 C60.1 C63.1 C64.1 C65.- C66.- D8.A D9.A Q7.1(S) Q7.2(S1) Q7.3(S2) Q8.1(S) Q8.2(S1) Q8.3(S2) R74.1 R75.1 R76.1 R77.1 R78.1 R79.1 U6.5(GND) U6.THERM U7.5(GND) U7.THERM ; also sheet 2,3,4,5,7
LPCTRL3: R73.1 ; also sheet 4
LPCTRL4: R72.1 ; also sheet 4
N$49: R79.2 R81.1 U7.1(UVLO)
N$50: C56.2 R73.2 R75.2 U7.2(IADJ)
N$51: Q8.4(G) R91.1 R93.2
N$52: C60.2 R84.1 R85.2 U7.4(COFF)
N$53: C62.1 U7.9(VCC)
N$54: Q6.E(S) R89.2 U7.7(CSN)
N$55: Q6.B(G) R87.1 ZD4.A
N$56: R87.2 U7.6(PGATE) ZD4.C
N$57: D9.C L8.P$1 L9.1 Q6.C(D)
N$58: R78.2 R80.1 U6.1(UVLO)
N$59: C55.2 R72.2 R74.2 U6.2(IADJ)
N$60: Q7.4(G) R90.1 R92.2
N$61: C59.2 R82.1 R83.2 U6.4(COFF)
N$62: C61.1 U6.9(VCC)
N$63: Q5.E(S) R88.2 U6.7(CSN)
N$64: Q5.B(G) R86.1 ZD3.A
N$65: R86.2 U6.6(PGATE) ZD3.C
N$66: D8.C L6.P$1 L7.1 Q5.C(D)
OFF3: R77.2 U7.3(EN) ; also sheet 3
OFF4: R76.2 U6.3(EN) ; also sheet 3
PINCH_3: R91.2 ; also sheet 3
PINCH_4: R90.2 ; also sheet 3
VRAIL [power]: C51.1 C52.1 C53.1 C54.1 C57.1 C58.1 C61.2 C62.2 R80.2 R81.2 R82.2 R84.2 R88.1 R89.1 U6.8(CSP) U6.10(VIN) U7.8(CSP) U7.10(VIN) ; also sheet 2,3,5,7

### Notes on the sheet
- Proprietary and Confidential NBCUniversal Media LLC
- The NED Group
- 9221 E. Baseline Road, Suite 109-492 Mesa, AZ  85209
- Cineo_6-Channel_Buck | A0

## Sheet 7 of 7
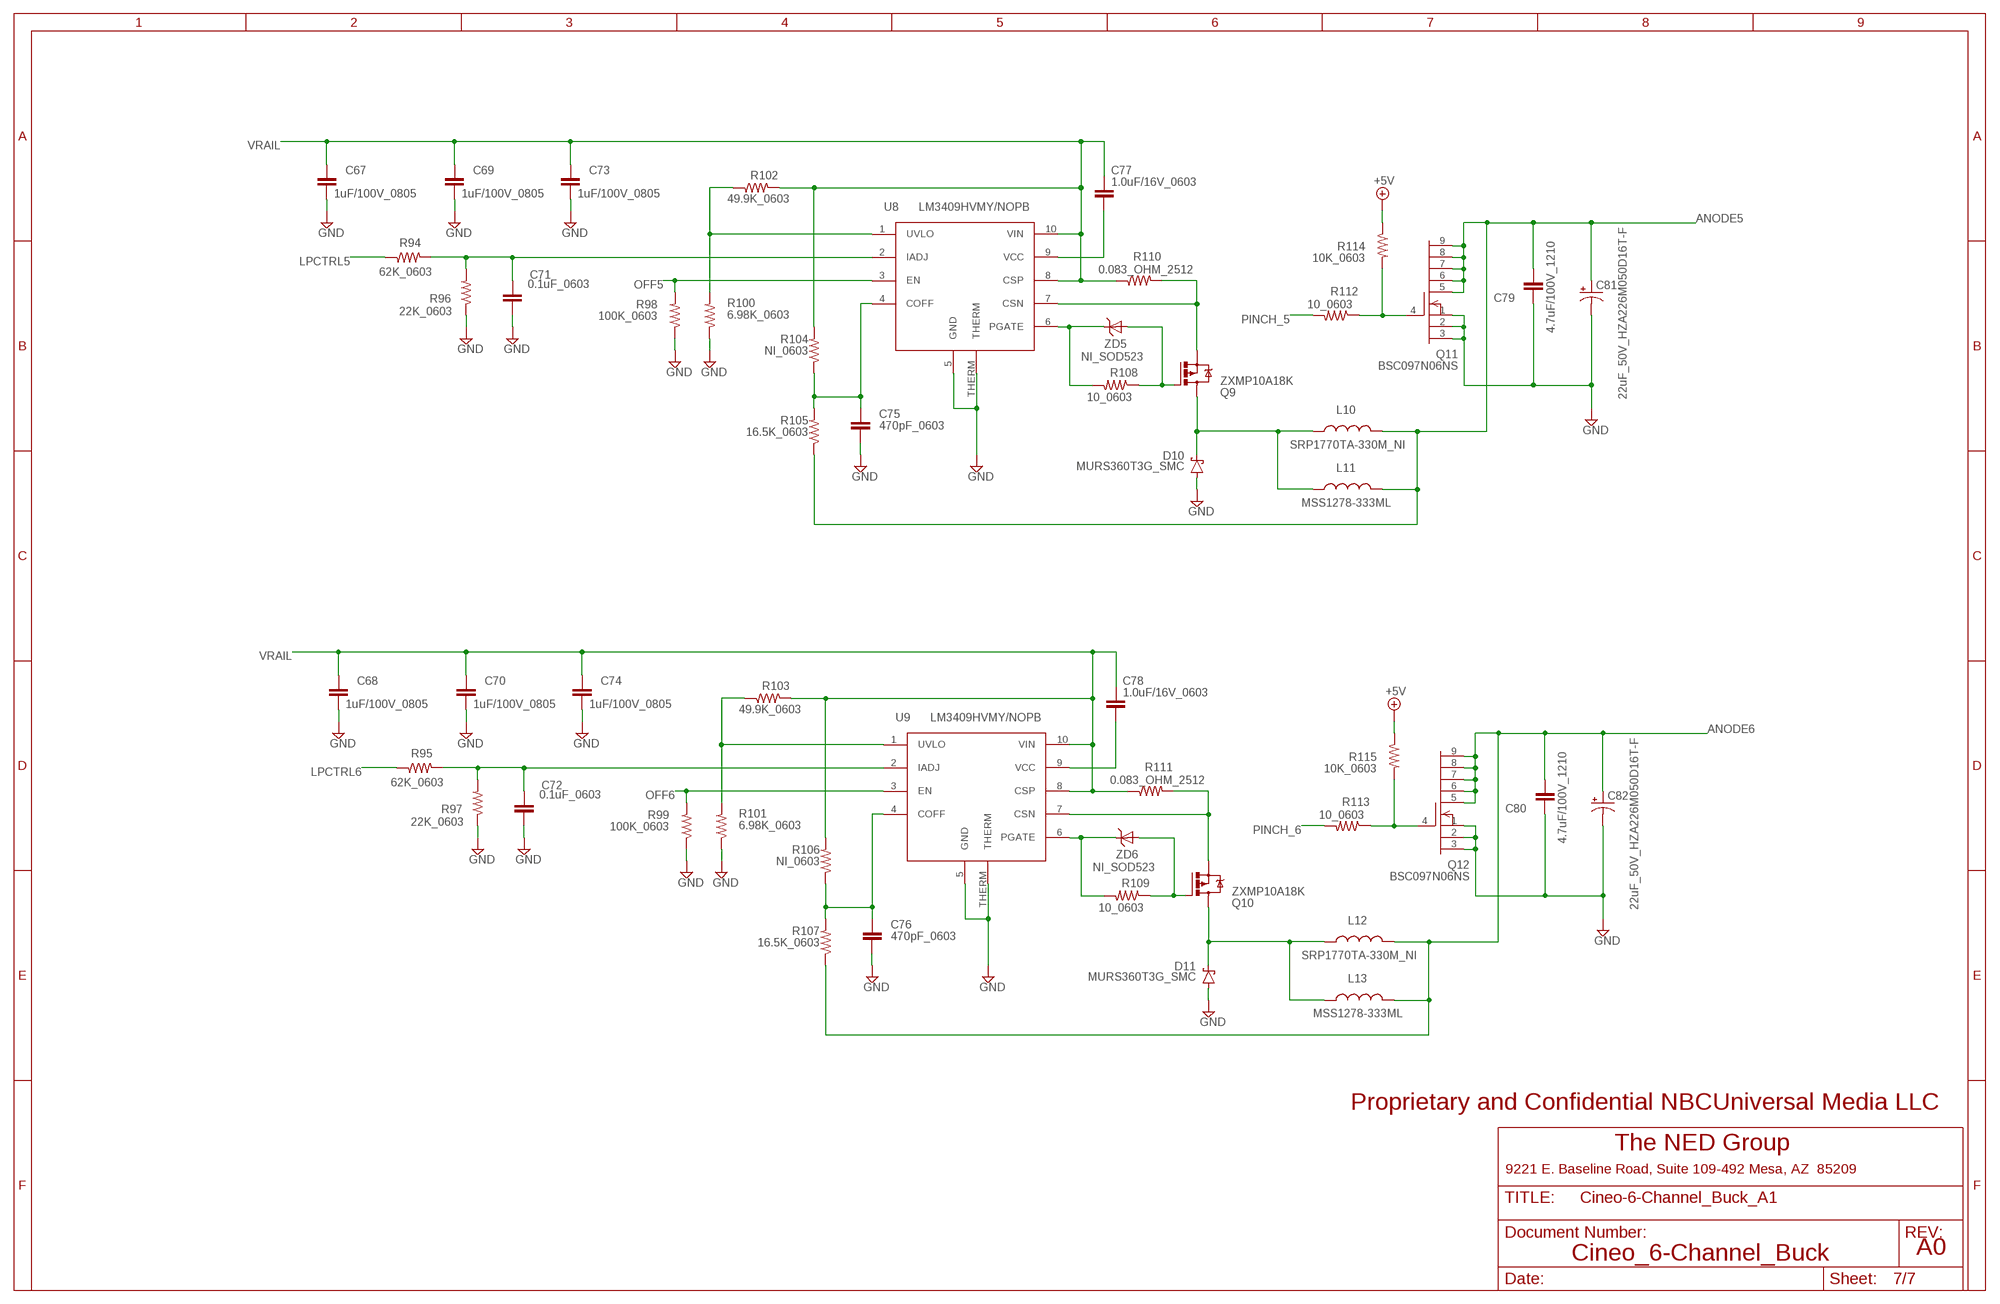
[diagram p6: schematic, sheet 7]

### Parts
C67  1uF/100V_0805  C-EUC0805  [C0805]
C68  1uF/100V_0805  C-EUC0805  [C0805]
C69  1uF/100V_0805  C-EUC0805  [C0805]
C70  1uF/100V_0805  C-EUC0805  [C0805]
C71  0.1uF_0603  C-EUC0603  [C0603]
C72  0.1uF_0603  C-EUC0603  [C0603]
C73  1uF/100V_0805  C-EUC0805  [C0805]
C74  1uF/100V_0805  C-EUC0805  [C0805]
C75  470pF_0603  C-EUC0603  [C0603]
C76  470pF_0603  C-EUC0603  [C0603]
C77  1.0uF/16V_0603  C-EUC0603  [C0603]
C78  1.0uF/16V_0603  C-EUC0603  [C0603]
C79  4.7uF/100V_1210  C-EUC1210  [C1210]
C80  4.7uF/100V_1210  C-EUC1210  [C1210]
C81  22uF_50V_HZA226M050D16T-F  CPOL-USD  [PANASONIC_D]
C82  22uF_50V_HZA226M050D16T-F  CPOL-USD  [PANASONIC_D]
D10  MURS360T3G_SMC  SCHOTTKY-DIODESMC  [SMC]
D11  MURS360T3G_SMC  SCHOTTKY-DIODESMC  [SMC]
L10  SRP1770TA-330M_NI  BOURNS_SRP1770TA  [BOURNS_SRP1770TA]
L11  MSS1278-333ML  COILCRAFT_MSS1260  [MSS1260]
L12  SRP1770TA-330M_NI  BOURNS_SRP1770TA  [BOURNS_SRP1770TA]
L13  MSS1278-333ML  COILCRAFT_MSS1260  [MSS1260]
Q9  ZXMP10A18K  MOSFET_P-CHANNEL_3LEADTAB_SOURCE  [DPAK]
Q10  ZXMP10A18K  MOSFET_P-CHANNEL_3LEADTAB_SOURCE  [DPAK]
Q11  BSC097N06NS  SI7464DP_SO8_POWERPAC  [SO-8_POWERPAC]
Q12  BSC097N06NS  SI7464DP_SO8_POWERPAC  [SO-8_POWERPAC]
R94  62K_0603  R-US_R0603  [R0603]
R95  62K_0603  R-US_R0603  [R0603]
R96  22K_0603  R-US_R0603  [R0603]
R97  22K_0603  R-US_R0603  [R0603]
R98  100K_0603  R-US_R0603  [R0603]
R99  100K_0603  R-US_R0603  [R0603]
R100  6.98K_0603  R-US_R0603  [R0603]
R101  6.98K_0603  R-US_R0603  [R0603]
R102  49.9K_0603  R-US_R0603  [R0603]
R103  49.9K_0603  R-US_R0603  [R0603]
R104  NI_0603  R-US_R0603  [R0603]
R105  16.5K_0603  R-US_R0603  [R0603]
R106  NI_0603  R-US_R0603  [R0603]
R107  16.5K_0603  R-US_R0603  [R0603]
R108  10_0603  R-US_R0603  [R0603]
R109  10_0603  R-US_R0603  [R0603]
R110  0.083_OHM_2512  R-US_R2512  [R2512]
R111  0.083_OHM_2512  R-US_R2512  [R2512]
R112  10_0603  R-US_R0603  [R0603]
R113  10_0603  R-US_R0603  [R0603]
R114  10K_0603  R-US_R0603  [R0603]
R115  10K_0603  R-US_R0603  [R0603]
U8  LM3409HVMY/NOPB  LM3409HV  [MSOP10-THERMALENHANCED]
U9  LM3409HVMY/NOPB  LM3409HV  [MSOP10-THERMALENHANCED]
ZD5  NI_SOD523  ZENER_SOD-523  [SOD-523]
ZD6  NI_SOD523  ZENER_SOD-523  [SOD-523]

### Nets
+5V: R114.1 R115.1 ; also sheet 2,3,4,5,6
ANODE5: C79.2 C81.+ L10.P$2 L11.2 Q11.5(D) Q11.6(D1) Q11.7(D2) Q11.8(D3) Q11.9(D4) R105.1 ; also sheet 5
ANODE6: C80.2 C82.+ L12.P$2 L13.2 Q12.5(D) Q12.6(D1) Q12.7(D2) Q12.8(D3) Q12.9(D4) R107.1 ; also sheet 5
GND [power]: C67.2 C68.2 C69.2 C70.2 C71.1 C72.1 C73.2 C74.2 C75.1 C76.1 C79.1 C80.1 C81.- C82.- D10.A D11.A Q11.1(S) Q11.2(S1) Q11.3(S2) Q12.1(S) Q12.2(S1) Q12.3(S2) R96.1 R97.1 R98.1 R99.1 R100.1 R101.1 U8.5(GND) U8.THERM U9.5(GND) U9.THERM ; also sheet 2,3,4,5,6
LPCTRL5: R94.1 ; also sheet 4
LPCTRL6: R95.1 ; also sheet 4
N$77: R100.2 R102.1 U8.1(UVLO)
N$78: C71.2 R94.2 R96.2 U8.2(IADJ)
N$79: Q11.4(G) R112.1 R114.2
N$81: C75.2 R104.1 R105.2 U8.4(COFF)
N$83: C77.1 U8.9(VCC)
N$84: Q9.E(S) R110.2 U8.7(CSN)
N$85: Q9.B(G) R108.1 ZD5.A
N$86: R108.2 U8.6(PGATE) ZD5.C
N$87: D10.C L10.P$1 L11.1 Q9.C(D)
N$99: R101.2 R103.1 U9.1(UVLO)
N$100: C72.2 R95.2 R97.2 U9.2(IADJ)
N$101: Q12.4(G) R113.1 R115.2
N$102: C76.2 R106.1 R107.2 U9.4(COFF)
N$103: C78.1 U9.9(VCC)
N$104: Q10.E(S) R111.2 U9.7(CSN)
N$105: Q10.B(G) R109.1 ZD6.A
N$106: R109.2 U9.6(PGATE) ZD6.C
N$107: D11.C L12.P$1 L13.1 Q10.C(D)
OFF5: R98.2 U8.3(EN) ; also sheet 3
OFF6: R99.2 U9.3(EN) ; also sheet 3
PINCH_5: R112.2 ; also sheet 3
PINCH_6: R113.2 ; also sheet 3
VRAIL [power]: C67.1 C68.1 C69.1 C70.1 C73.1 C74.1 C77.2 C78.2 R102.2 R103.2 R104.2 R106.2 R110.1 R111.1 U8.8(CSP) U8.10(VIN) U9.8(CSP) U9.10(VIN) ; also sheet 2,3,5,6

### Notes on the sheet
- Proprietary and Confidential NBCUniversal Media LLC
- The NED Group
- 9221 E. Baseline Road, Suite 109-492 Mesa, AZ  85209
- Cineo_6-Channel_Buck | A0

## Library data of the parts
C1 C4 C5 C7-C9 C13 C14 C16 = Illum_CAP:0603_; PART_NUM: CAP-00240
C2 = Illum_CAP:0603_; PART_NUM: CAP-00302
C3 = Illum_CAP:1206_; PART_NUM: CAP-00301
C6 C10-C12 C15 = Illum_CAP:0603_; PART_NUM: CAP-00381
C17-C48 C51-C64 C67-C80 = rcl:C-EU: CAPACITOR, European symbol
C49 C50 C65 C66 C81 C82 = rcl:CPOL-US: POLARIZED CAPACITOR, American symbol
D1 D3 = Illum_DIO:ROHM_RB160VA-40: Diode, RB160VA, Schottky, 40V, 1A, TUMD2; PART_NUM: DIO-00001
D2 = jimrhodes:ZENER
D4 = diode:DIODE-: DIODE
D5 = jimrhodes:RSX051VA-30
D6-D11 = diode:SCHOTTKY-DIODE: Schottky Diode
FID1-FID3 = jimrhodes:FIDUCIALS; PART_NUM: DNI-00000
IC1 IC2 = linear:TLC274: OP AMP
J1 J2 = jimrhodes:AVX_709296001004006; PART_NUM: CON-00273
J3-J5 = jimrhodes_managed:MOLEX_874370343
J6 = jimrhodes:5-PIN-HEADER-SMT_.100; PART_NUM: NOT INSTALLED
J7 = jimrhodes_managed:MOLEX_5600200220
J8 = Illum_CON:MOLEX_47346: Connector, USB Female, Type A Micro, 5 Pos, 1.8 A 100V, Right Angle, SMT; PART_NUM: CON-00076
J9 J10 = jimrhodes_managed:JST_PHD_12-POS
L1 = Illum_IND:COILCRAFT_LPS6225; PART_NUM: IND-00128
L2 L4 L6 L8 L10 L12 = jimrhodes_managed:BOURNS_SRP1770TA
L3 L5 L7 L9 L11 L13 = jimrhodes:COILCRAFT_MSS1260
LED1-LED3 = led:LED: LED OSRAM: - CHIPLED LG R971, LG N971, LY N971, LG Q971, LY Q971, LO R971, LY R971 LH N974, LH R974 LS Q976, LO Q976, LY Q976 LO Q996 - Hyper CHIPLED LW Q18S LB Q993, LB Q99A, LB R99A - SideLED LS A670, LO A670, LY A670, LG A670, LP A670 LB A673, LV A673, LT A673, LW A673 LH A674 LY A675 LS A676, LA A676, LO A676, LY A676, LW A676 LS A679, LY A679, LG A679 - Hyper Micro SIDELED® LS Y876, LA Y876, LO Y876, LY Y876 LT Y87S - SmartLED LW L88C, LW L88S LB L89C, LB L89S, LG L890 LS L89K, LO L89K, LY L89K LS L896, LA L896, LO L896, LY L896 - TOPLED LS T670, LO T670, LY T670, LG T670, LP T670 LSG T670, LSP T670, LSY T670, LOP T670, LYG T670 LG T671, LOG T671, LSG T671 LB T673, LV T673, LT T673, LW T673 LH T674 LS T676, LA T676, LO T676, LY T676, LB T676, LH T676, LSB T676, LW T676 LB T67C, LV T67C, LT T67C, LS T67K, LO T67K, LY T67K, LW E67C LS E67B, LA E67B, LO E67B, LY E67B, LB E67C, LV E67C, LT E67C LW T67C LS T679, LY T679, LG T679 LS T770, LO T770, LY T770, LG T770, LP T770 LB T773, LV T773, LT T773, LW T773 LH T774 LS E675, LA E675, LY E675, LS T675 LS T776, LA T776, LO T776, LY T776, LB T776 LHGB T686 LT T68C, LB T68C - Hyper Mini TOPLED® LB M676 - Mini TOPLED Santana® LG M470 LS M47K, LO M47K, LY M47K Source: http://www.osram.convergy.de LUXEON: - LUMILED® LXK2-PW12-R00, LXK2-PW12-S00, LXK2-PW14-U00, LXK2-PW14-V00 LXK2-PM12-R00, LXK2-PM12-S00, LXK2-PM14-U00 LXK2-PE12-Q00, LXK2-PE12-R00, LXK2-PE12-S00, LXK2-PE14-T00, LXK2-PE14-U00 LXK2-PB12-K00, LXK2-PB12-L00, LXK2-PB12-M00, LXK2-PB14-N00, LXK2-PB14-P00, LXK2-PB14-Q00 LXK2-PR12-L00, LXK2-PR12-M00, LXK2-PR14-Q00, LXK2-PR14-R00 LXK2-PD12-Q00, LXK2-PD12-R00, LXK2-PD12-S00 LXK2-PH12-R00, LXK2-PH12-S00 LXK2-PL12-P00, LXK2-PL12-Q00, LXK2-PL12-R00 Source: www.luxeon.com KINGBRIGHT: KA-3528ASYC Source: www.kingbright.com
P1 = jimrhodes:FTSH-105-01-L-DV-K; PART_NUM: CON-00037
Q1 Q2 Q5 Q6 Q9 Q10 = jimrhodes:MOSFET_P-CHANNEL_3LEAD
Q3 Q4 Q7 Q8 Q11 Q12 = jimrhodes:SI7464DP_SO8_POWERPAC
R1 = Illum_RES:0603_; PART_NUM: RES-00263
R2 = Illum_RES:0603_; PART_NUM: RES-00002
R3 = Illum_RES:0603_; PART_NUM: RES-00015
R4-R47 R49 R50 R52-R115 = rcl:R-US_: RESISTOR, American symbol
R48 R51 = Illum_RES:0603_; PART_NUM: RES-00001
S1 = switch-dil:219-04*: Surface Mount DIP Switch Series 219 SMT CTS Electronic Components Sourc: www.ctscorp.com; OC_FARNELL: unknown; OC_NEWARK: unknown
U1 = Illum_ICC:MPS_MP2459GJ: IC, MPS MP2459GJ, Regulator Controller, 4.5V to 55V Input, 500mA Output, 812mV reference, SMT, TSOT 23-6, -40C - 125C..; PART_NUM: ICC-00074
U2 = Illum_ICC:TI_SN65HVD1782DR: IC, Texas Instruments SN65HVD1782DR, RS-485 Transceiver, 70V Protection, 1/8 load, SOIC-8; PART_NUM: ICC-00036
U3 = Illum_ICC:CYPRESS_CY8C52XX_100PIN: IC, CY8C52xx; PART_NUM: ICC-00167
U4-U9 = jimrhodes_managed:LM3409HV
Z1-Z3 = jimrhodes:TISP4360H3BJ
ZD1-ZD6 = jimrhodes:ZENER_SOD-523

## Net classes
0 default: width 0.152 mm, drill 0.254 mm, clearance 0.203 mm
1 power: width 0.203 mm, drill 0.254 mm, clearance 0.203 mm
2 5V: width 0.254 mm, drill 0.254 mm, clearance 0.203 mm